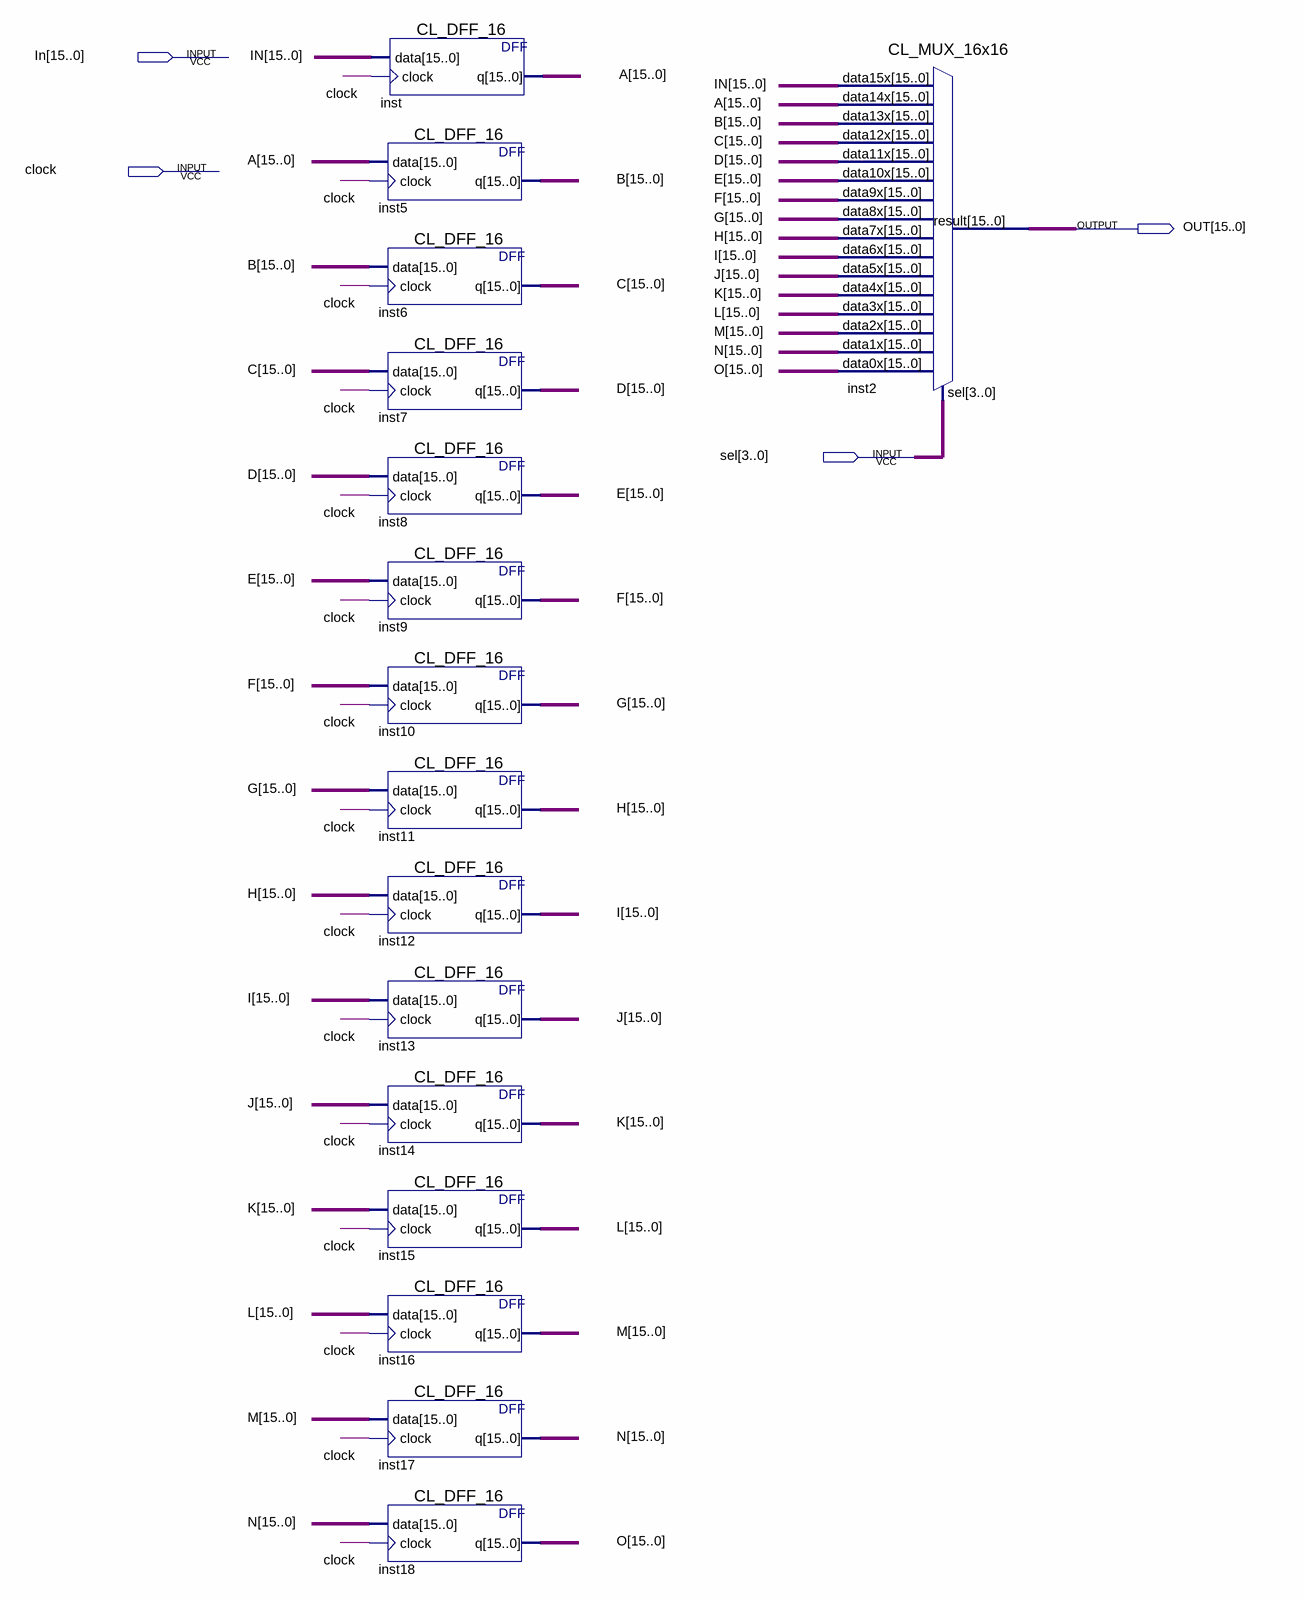
[diagram p0: schematic sheet]
// Quartus schematic CL_ProgDelay16x16.bdf as structural Verilog: 16 symbols, 4 pins
module CL_ProgDelay16x16 (
  input  [15:0] In,
  input  clock,
  input  [3:0] sel,
  output [15:0] OUT
);

  wire [15:0] A, B, C, D, E, F, G, H, I, J, K, L, M, N, O;

  CL_DFF_16 inst (.data(In), .clock(clock), .q(A));
  CL_DFF_16 inst5 (.data(A), .clock(clock), .q(B));
  CL_DFF_16 inst6 (.data(B), .clock(clock), .q(C));
  CL_DFF_16 inst7 (.data(C), .clock(clock), .q(D));
  CL_DFF_16 inst8 (.data(D), .clock(clock), .q(E));
  CL_DFF_16 inst9 (.data(E), .clock(clock), .q(F));
  CL_DFF_16 inst10 (.data(F), .clock(clock), .q(G));
  CL_DFF_16 inst11 (.data(G), .clock(clock), .q(H));
  CL_DFF_16 inst12 (.data(H), .clock(clock), .q(I));
  CL_DFF_16 inst13 (.data(I), .clock(clock), .q(J));
  CL_DFF_16 inst14 (.data(J), .clock(clock), .q(K));
  CL_DFF_16 inst15 (.data(K), .clock(clock), .q(L));
  CL_DFF_16 inst16 (.data(L), .clock(clock), .q(M));
  CL_DFF_16 inst17 (.data(M), .clock(clock), .q(N));
  CL_DFF_16 inst18 (.data(N), .clock(clock), .q(O));
  CL_MUX_16x16 inst2 (
    .data15x(In), .data14x(A), .data13x(B), .data12x(C), .data11x(D), .data10x(E), .data9x(F), .data8x(G),
    .data7x(H), .data6x(I), .data5x(J), .data4x(K), .data3x(L), .data2x(M), .data1x(N), .data0x(O),
    .sel(sel), .result(OUT));
endmodule
